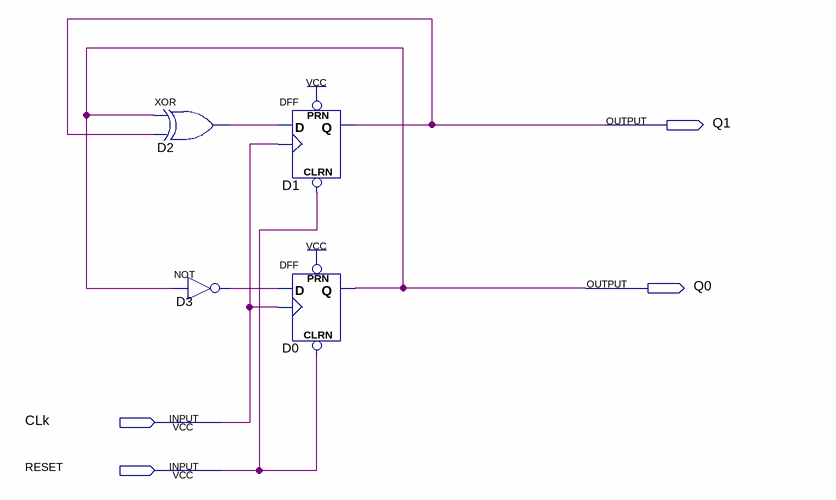
[diagram p0: schematic sheet]
// Quartus schematic SimpleCounter.bdf as structural Verilog: 4 symbols, 4 pins
module SimpleCounter (
  input  CLk,
  input  RESET,
  output Q1,
  output Q0
);

  wire D2_out, D3_out;

  xor D2 (D2_out, Q0, Q1);
  not D3 (D3_out, Q0);
  DFF D1 (.CLRN(RESET), .CLK(CLk), .D(D2_out), .PRN(1'b1), .Q(Q1));
  DFF D0 (.CLRN(RESET), .CLK(CLk), .D(D3_out), .PRN(1'b1), .Q(Q0));
endmodule
